# EAGLE design CR6 (EAGLE 9.6.2)
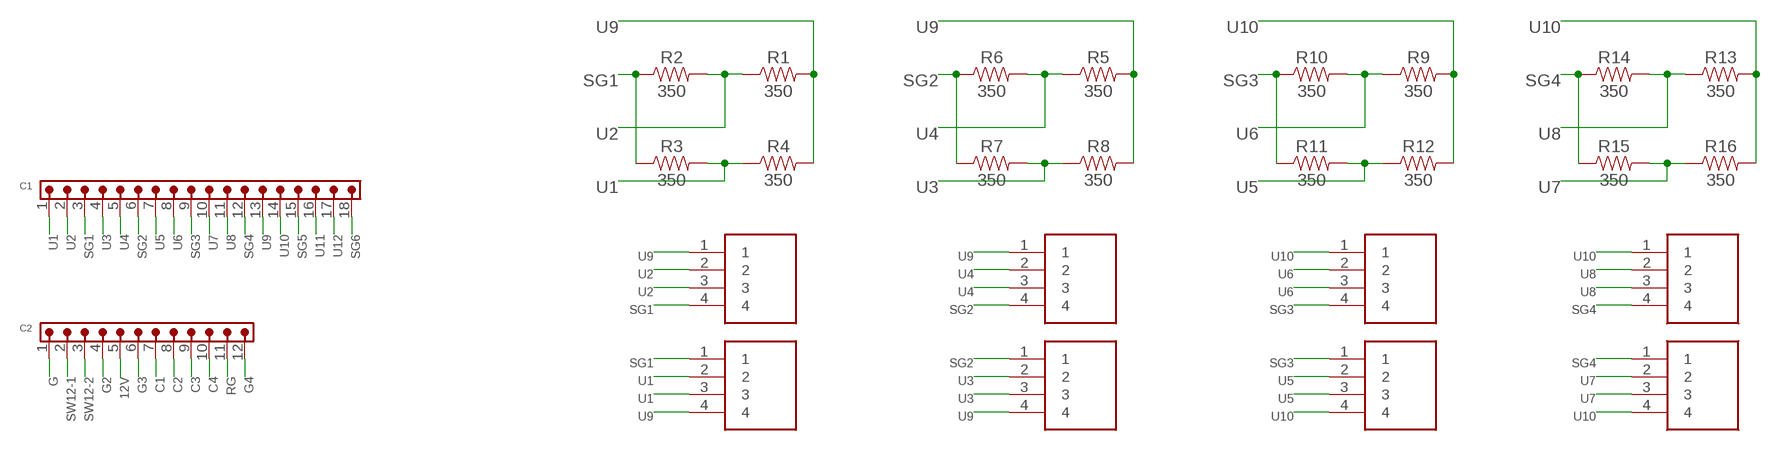
[diagram p0: schematic, sheet 1]

## Parts
C1  WURTH_CONNECTORS_WR-TBL-PLUGGABLE-CONNECTOR_691311500018  [WURTH_CONNECTORS_WR-TBL-PLUGGABLE-CONNECTOR_691311500018]
C2  WURTH_CONNECTORS_WR-TBL-PLUGGABLE-CONNECTOR_691311500012  [WURTH_CONNECTORS_WR-TBL-PLUGGABLE-CONNECTOR_691311500012]
J1  1725672  [1725672-4-2.54]
J2  1725672  [1725672-4-2.54]
J5  1725672  [1725672-4-2.54]
J6  1725672  [1725672-4-2.54]
J9  1725672  [1725672-4-2.54]
J10  1725672  [1725672-4-2.54]
J13  1725672  [1725672-4-2.54]
J14  1725672  [1725672-4-2.54]
R1  350  330OHM-HORIZ-1/10W-5%  [AXIAL-0.3]
R2  350  330OHM-HORIZ-1/10W-5%  [AXIAL-0.3]
R3  350  330OHM-HORIZ-1/10W-5%  [AXIAL-0.3]
R4  350  330OHM-HORIZ-1/10W-5%  [AXIAL-0.3]
R5  350  330OHM-HORIZ-1/10W-5%  [AXIAL-0.3]
R6  350  330OHM-HORIZ-1/10W-5%  [AXIAL-0.3]
R7  350  330OHM-HORIZ-1/10W-5%  [AXIAL-0.3]
R8  350  330OHM-HORIZ-1/10W-5%  [AXIAL-0.3]
R9  350  330OHM-HORIZ-1/10W-5%  [AXIAL-0.3]
R10  350  330OHM-HORIZ-1/10W-5%  [AXIAL-0.3]
R11  350  330OHM-HORIZ-1/10W-5%  [AXIAL-0.3]
R12  350  330OHM-HORIZ-1/10W-5%  [AXIAL-0.3]
R13  350  330OHM-HORIZ-1/10W-5%  [AXIAL-0.3]
R14  350  330OHM-HORIZ-1/10W-5%  [AXIAL-0.3]
R15  350  330OHM-HORIZ-1/10W-5%  [AXIAL-0.3]
R16  350  330OHM-HORIZ-1/10W-5%  [AXIAL-0.3]

## Nets
12V: C2.5
C1: C2.7
C2: C2.8
C3: C2.9
C4: C2.10
G: C2.1
G2: C2.4
G3: C2.6
G4: C2.12
RG: C2.11
SG1: C1.3 J1.4 J2.1 R2.P$1 R3.P$1
SG2: C1.6 J5.4 J6.1 R6.P$1 R7.P$1
SG3: C1.9 J9.4 J10.1 R10.P$1 R11.P$1
SG4: C1.12 J13.4 J14.1 R14.P$1 R15.P$1
SG5: C1.15
SG6: C1.18
SW12-1: C2.2
SW12-2: C2.3
U1: C1.1 J2.2 J2.3 R3.P$2 R4.P$1
U2: C1.2 J1.2 J1.3 R1.P$1 R2.P$2
U3: C1.4 J6.2 J6.3 R7.P$2 R8.P$1
U4: C1.5 J5.2 J5.3 R5.P$1 R6.P$2
U5: C1.7 J10.2 J10.3 R11.P$2 R12.P$1
U6: C1.8 J9.2 J9.3 R9.P$1 R10.P$2
U7: C1.10 J14.2 J14.3 R15.P$2 R16.P$1
U8: C1.11 J13.2 J13.3 R13.P$1 R14.P$2
U9: C1.13 J1.1 J2.4 J5.1 J6.4 R1.P$2 R4.P$2 R5.P$2 R8.P$2
U10: C1.14 J9.1 J10.4 J13.1 J14.4 R9.P$2 R12.P$2 R13.P$2 R16.P$2
U11: C1.16
U12: C1.17

## Library data of the parts
C1 = CR6:WURTH_CONNECTORS_WR-TBL-PLUGGABLE-CONNECTOR_691311500018: WR-TBL Serie 311 - 5.08 mm Open Vertical PCB Header KIND PROPERTIES Pitch 5.08 mm MATERIAL PROPERTIES Insulator Material PBT Insulator Flammability Rating UL94 V-0 Contact Material Brass Contact Plating Tin GENERAL INFORMATION Operating Temperature -40 up to +105 °C ELECTRICAL PROPERTIES IR cULus 20 A IR VDE 20 A Working Voltage [cULus] 300 V (AC) Working Voltage [VDE] 300 V (AC) Withstanding Voltage [cULus] 1600 V (AC) Withstanding Voltage [VDE] 2500 V (AC) Contact Resistance [cULus] 20 mΩ Contact Resistance [VDE] 20 mΩ CERTIFICATION cULus Approval E315414 VDE Approval 40023195 <https://www.we-online.com/catalog/media/o33257v209%20Family_WR-TBL_6913115000xx.jpg> Details see: https://www.we-online.com/catalog/en/TBL_5_08_311_OPEN_VERTICAL_PCB_HEADER_6913115000XX/ Updated by Ella Wu 2019-12-25 2019(C) Wurth Elektronik; DATASHEET-URL: https://www.we-online.com/catalog/datasheet/691311500018.pdf; IR-UL: 20A; IR-VDE: 20A; MOUNT: THT; PART-NUMBER: 691311500018; PINS: 18; PITCH: 5.08mm; TYPE: Vertical; WORKING-VOLTAGE-UL: 300V (AC); WORKING-VOLTAGE-VDE: 300V (AC)
C2 = CR6:WURTH_CONNECTORS_WR-TBL-PLUGGABLE-CONNECTOR_691311500012: WR-TBL Serie 311 - 5.08 mm Open Vertical PCB Header KIND PROPERTIES Pitch 5.08 mm MATERIAL PROPERTIES Insulator Material PBT Insulator Flammability Rating UL94 V-0 Contact Material Brass Contact Plating Tin GENERAL INFORMATION Operating Temperature -40 up to +105 °C ELECTRICAL PROPERTIES IR cULus 20 A IR VDE 20 A Working Voltage [cULus] 300 V (AC) Working Voltage [VDE] 300 V (AC) Withstanding Voltage [cULus] 1600 V (AC) Withstanding Voltage [VDE] 2500 V (AC) Contact Resistance [cULus] 20 mΩ Contact Resistance [VDE] 20 mΩ CERTIFICATION cULus Approval E315414 VDE Approval 40023195 <https://www.we-online.com/catalog/media/o33257v209%20Family_WR-TBL_6913115000xx.jpg> Details see: https://www.we-online.com/catalog/en/TBL_5_08_311_OPEN_VERTICAL_PCB_HEADER_6913115000XX/ Updated by Ella Wu 2019-12-25 2019(C) Wurth Elektronik; DATASHEET-URL: https://www.we-online.com/catalog/datasheet/691311500012.pdf; IR-UL: 20A; IR-VDE: 20A; MOUNT: THT; PART-NUMBER: 691311500012; PINS: 12; PITCH: 5.08mm; TYPE: Vertical; WORKING-VOLTAGE-UL: 300V (AC); WORKING-VOLTAGE-VDE: 300V (AC)
J1 J2 J5 J6 J9 J10 J13 J14 = Backplate_2:1725672: 4 way vertical PCB terminal,6A 63V Phoenix Contact Non-Fused Terminal Block, 4 Way, Solder Terminals, 26 ??? 20 AWG Through Hole, Nylon, 63 V Source: Datasheet <https://www.phoenixcontact.com/online/portal/us?uri=pxc-oc-itemdetail:pid=1725672&library=usen&tab=1.pdf>; ALLIED_NUMBER: 70054337; DESCRIPTION: 4 way vertical PCB terminal,6A 63V Phoenix Contact Non-Fused Terminal Block, 4 Way, Solder Terminals, 26 ??? 20 AWG Through Hole, Nylon, 63 V; HEIGHT: mm; MANUFACTURER_NAME: Phoenix Contact; MANUFACTURER_PART_NUMBER: 1725672; RS_PART_NUMBER: 3924476; RS_PRICE-STOCK: https://uk.rs-online.com/web/p/products/3924476
R1-R16 = SparkFun-Resistors:330OHM: 330Ω resistor A resistor is a passive two-terminal electrical component that implements electrical resistance as a circuit element. Resistors act to reduce current flow, and, at the same time, act to lower voltage levels within circuits. - Wikipedia; PROD_ID: RES-8371; VALUE: 330

## Net classes
0 default: width 0.203 mm

## Board
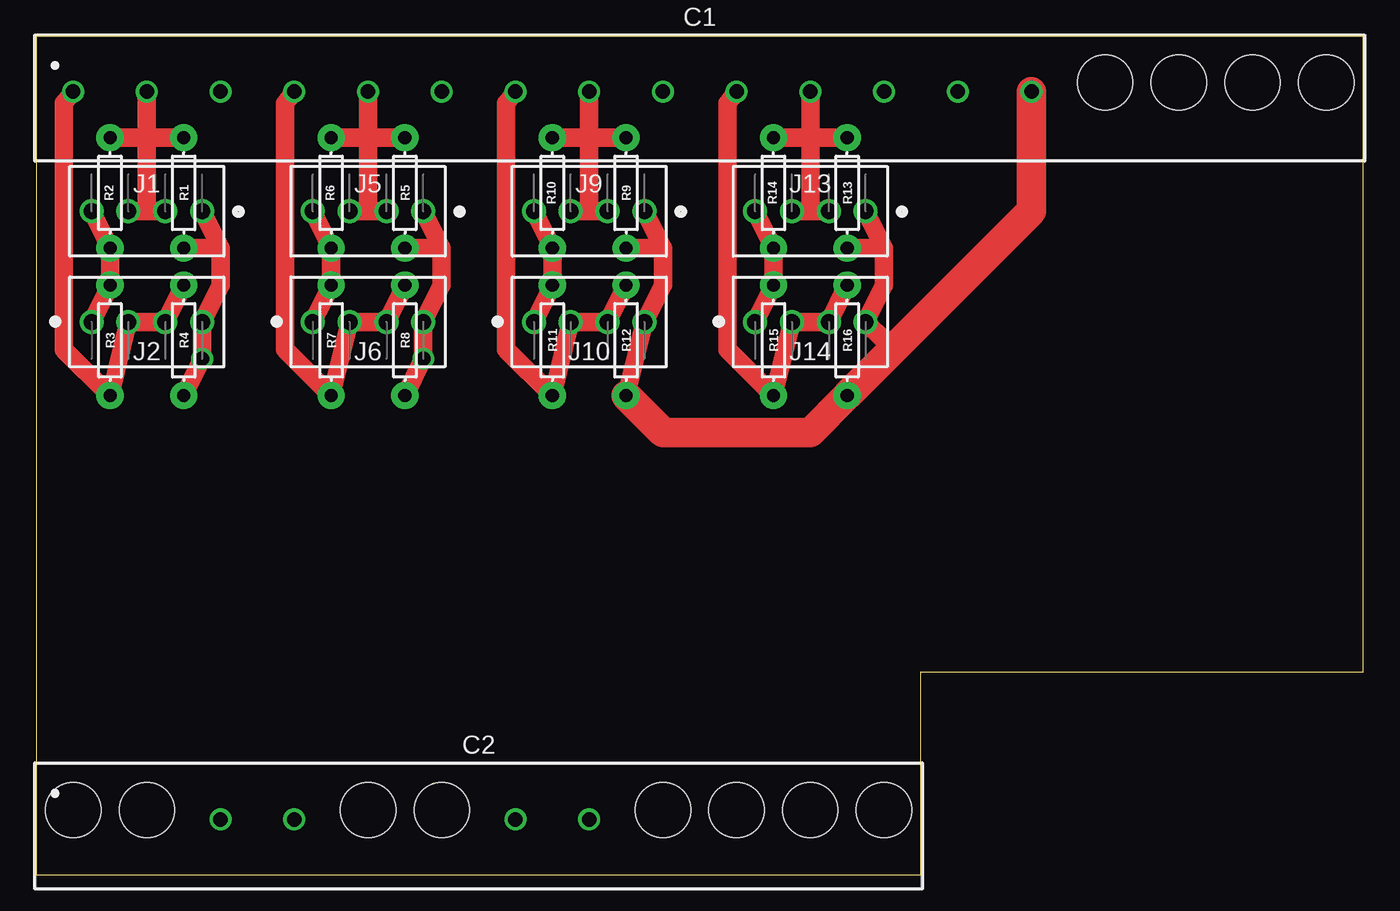
[diagram p1: board, top side]
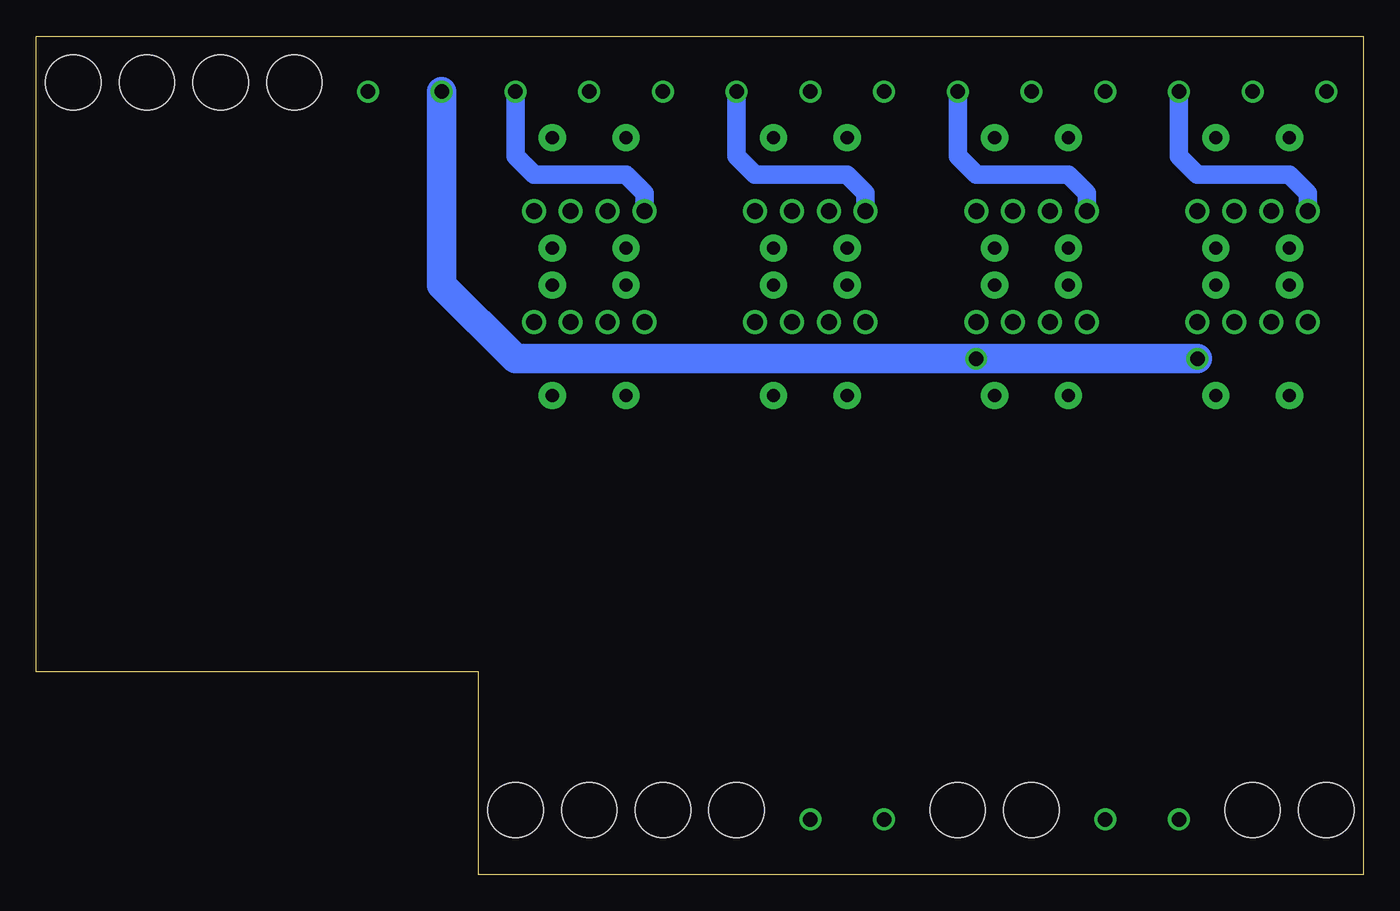
[diagram p2: board, bottom side, seen from below]

Size 91.44 x 57.78 mm. Coordinates in mm from the lower left corner, seen from the top.
Outline: 0,0 60.96,0 60.96,13.97 91.44,13.97 91.44,57.78 0,57.78 0,0
Copper layers (1*16): Top 0.035mm / dielectric 1.5mm / Bottom 0.035mm
Design rules "default": minimum track width 6mil, minimum drill 0.35mm, track to track 6mil, track to pad 6mil, pad to pad 6mil, via to via 6mil, smd to smd 6mil, copper to edge 40mil, drill to drill 6mil, minimum pad ring 10mil, minimum via ring 8mil, stop-mask expansion 4mil, vias tented up to drill 0mil, thermal gap 10mil
Holes 3.81 mm at 2.54,4.45 7.62,4.45 22.86,4.45 27.94,4.45 43.18,4.45 48.26,4.45 53.34,4.45 58.42,4.45 73.66,54.61 78.74,54.61 83.82,54.61 88.9,54.61

### Footprints (pad centres in the part's own frame; a part is rotated, then mirrored left to right if it is on the bottom)
WURTH_CONNECTORS_WR-TBL-PLUGGABLE-CONNECTOR_691311500018 = drill 1: 1 -43.18,0; 2 -38.1,0; 3 -33.02,0; 4 -27.94,0; 5 -22.86,0; 6 -17.78,0; 7 -12.7,0; 8 -7.62,0; 9 -2.54,0; 10 2.54,0; 11 7.62,0; 12 12.7,0; 13 17.78,0; 14 22.86,0; 15 27.94,0; 16 33.02,0; 17 38.1,0; 18 43.18,0
WURTH_CONNECTORS_WR-TBL-PLUGGABLE-CONNECTOR_691311500012 = drill 1: 1 -27.94,0; 2 -22.86,0; 3 -17.78,0; 4 -12.7,0; 5 -7.62,0; 6 -2.54,0; 7 2.54,0; 8 7.62,0; 9 12.7,0; 10 17.78,0; 11 22.86,0; 12 27.94,0
1725672-4-2.54 = drill 1.1 pad 1.65: 1 0,0; 2 2.54,0; 3 5.08,0; 4 7.62,0
AXIAL-0.3 = drill 0.9 pad 1.88: P$1 -3.81,0; P$2 3.81,0

### Placement (x,y rotation side)
C1  45.72,53.98 0 top
C2  30.48,3.81 0 top
J1  11.43,45.72 180 top
J2  3.81,38.1 0 top
J5  26.67,45.72 180 top
J6  19.05,38.1 0 top
J9  41.91,45.72 180 top
J10  34.29,38.1 0 top
J13  57.15,45.72 180 top
J14  49.53,38.1 0 top
R1  10.16,46.99 270 top
R2  5.08,46.99 90 top
R3  5.08,36.83 270 top
R4  10.16,36.83 270 top
R5  25.4,46.99 270 top
R6  20.32,46.99 90 top
R7  20.32,36.83 270 top
R8  25.4,36.83 270 top
R9  40.64,46.99 270 top
R10  35.56,46.99 90 top
R11  35.56,36.83 270 top
R12  40.64,36.83 270 top
R13  55.88,46.99 270 top
R14  50.8,46.99 90 top
R15  50.8,36.83 270 top
R16  55.88,36.83 270 top

### Tracks (layer width: path | path; a pad name or v marks a point on that pad's centre or on a via)
SG1
  Top 1.27: J2.1 R3.P$1 R2.P$1 J1.4
  Bottom 1.27: J1.4 3.81,46.99 5.08,48.26 11.43,48.26 12.7,49.53 C1.3
SG2
  Top 1.27: J6.1 R7.P$1 R6.P$1 J5.4
  Bottom 1.27: J5.4 19.05,46.99 20.32,48.26 26.67,48.26 27.94,49.53 C1.6
SG3
  Top 1.27: J10.1 R11.P$1 R10.P$1 J9.4
  Bottom 1.27: J9.4 34.29,46.99 35.56,48.26 41.91,48.26 43.18,49.53 C1.9
SG4
  Top 1.27: J14.1 R15.P$1 R14.P$1 J13.4
  Bottom 1.27: J13.4 49.53,46.99 50.8,48.26 57.15,48.26 58.42,49.53 C1.12
U1
  Top 1.27: C1.1 1.91,53.17 1.91,36.2 R3.P$2 J2.2 J2.3 R4.P$1
U2
  Top 1.27: J1.3 7.62,45.72 | 7.62,45.72 J1.2 | R2.P$2 7.62,50.8 | R1.P$1 7.62,50.8 | 7.62,45.72 7.62,50.8 | 7.62,50.8 C1.2
U3
  Top 1.27: C1.4 17.14,53.17 17.14,36.2 R7.P$2 J6.2 J6.3 R8.P$1
U4
  Top 1.27: R6.P$2 22.86,50.8 | R5.P$1 22.86,50.8 | J5.2 22.86,45.72 | 22.86,45.72 J5.3 | 22.86,45.72 22.86,50.8 | 22.86,50.8 C1.5
U5
  Top 1.27: C1.7 32.38,53.17 32.38,36.2 R11.P$2 J10.2 J10.3 R12.P$1
U6
  Top 1.27: R10.P$2 38.1,50.8 | 38.1,50.8 R9.P$1 | 38.1,50.8 38.1,45.72 | 38.1,50.8 C1.8 | J9.3 38.1,45.72 | 38.1,45.72 J9.2
U7
  Top 1.27: C1.10 47.62,53.17 47.62,36.2 R15.P$2 J14.2 J14.3 R16.P$1
U8
  Top 1.27: J13.3 53.34,45.72 | J13.2 53.34,45.72 | 53.34,45.72 53.34,50.8 | 53.34,50.8 C1.11 | R14.P$2 53.34,50.8 | R13.P$1 53.34,50.8
U9  (via drill 1)
  Top 1.27: 27.94,43.18 27.94,40.64 J6.4 v26.67,35.56 R8.P$2 | 27.94,43.18 J5.1 | R5.P$2 27.94,43.18 | 12.7,43.18 12.7,40.64 J2.4 v11.43,35.56 R4.P$2 | 12.7,43.18 J1.1 | R1.P$2 12.7,43.18
  Bottom 2.032: v11.43,35.56 v26.67,35.56 58.42,35.56 63.5,40.64 C1.13
U10
  Top 1.27: 59.69,36.83 58.42,36.83 J14.4 58.42,40.64 58.42,43.18 | 58.42,43.18 J13.1 | R13.P$2 58.42,43.18 | 43.18,43.18 43.18,40.64 J10.4 R12.P$2 | 43.18,43.18 J9.1 | R9.P$2 43.18,43.18
  Top 2.032: R12.P$2 43.18,30.48 53.34,30.48 R16.P$2 59.69,36.83 68.58,45.72 C1.14